# EAGLE design MBus-WeMOS (EAGLE 9.3.2)
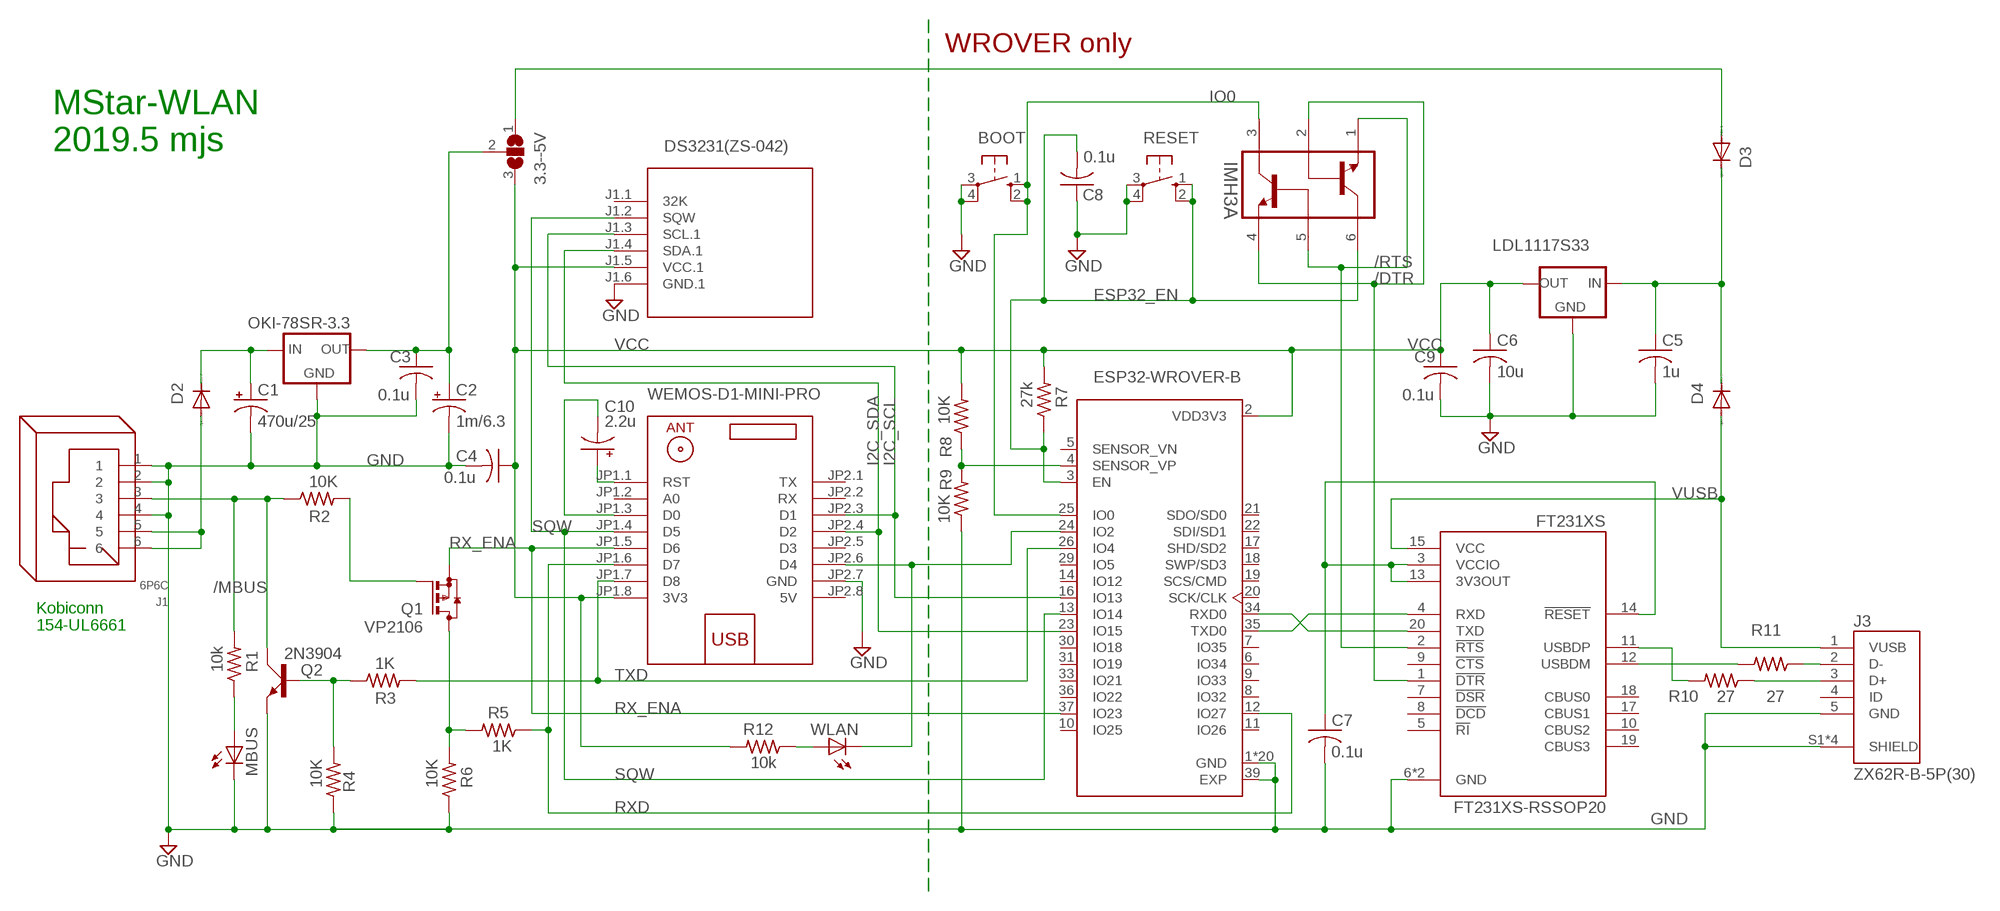
[diagram p0: schematic, sheet 1]

## Parts
3.3--5V  SJ2W  [SJ_2]
BOOT  10-XX  [B3F-10XX]
C1  470u/25  CPOL-USE3.5-8  [E3,5-8]
C2  1m/6.3  CPOL-USE5-10.5  [E5-10,5]
C3  0.1u  C-US025-024X044  [C025-024X044]
C4  0.1u  C-US025-024X044  [C025-024X044]
C5  1u  C-USC1206  [C1206]
C6  10u  C-USC1206  [C1206]
C7  0.1u  C-US025-024X044  [C025-024X044]
C8  0.1u  C-US025-024X044  [C025-024X044]
C9  0.1u  C-US025-024X044  [C025-024X044]
C10  2.2u  CPOL-USE2.5-5  [E2,5-5]
D2  DIODE-D-5  [D-5]
D3  DIODE-D-5  [D-5]
D4  DIODE-D-5  [D-5]
DS3231(ZS-042)  RTC-DS3231-AT24C32-6  [RTC-DS3231-AT24C32-6]
ESP32-WROVER-B  ESP32-WROVER-I  [XCVR_ESP32-WROVER-I]
FT231XS  FT231XS-RSSOP20  [SSOP20]
IMH3A  IMH3ATSOP6  [TSOP6]
J1  6P6C  RJ12  [RJ12]
J3  ZX62R-B-5P(30)  [HRS_ZX62R-B-5P(30)]
LDL1117S33  LM1117MP-3.3  [SOT223]
MBUS  LED3MM  [LED3MM]
OKI-78SR-3.3  78MXXS  [78MXXS]
Q1  VP2106  [TO92]
Q2  2N3904  [TO92D]
R1  10k  R-US_0207/2V  [0207/2V]
R2  10K  R-US_0207/2V  [0207/2V]
R3  1K  R-US_0207/2V  [0207/2V]
R4  10K  R-US_0207/2V  [0207/2V]
R5  1K  R-US_0207/2V  [0207/2V]
R6  10K  R-US_0207/2V  [0207/2V]
R7  27k  R-US_0207/2V  [0207/2V]
R8  10K  R-US_0207/2V  [0207/2V]
R9  10K  R-US_0207/2V  [0207/2V]
R10  27  R-US_0207/2V  [0207/2V]
R11  27  R-US_0207/2V  [0207/2V]
R12  10k  R-US_0207/2V  [0207/2V]
RESET  10-XX  [B3F-10XX]
U$1  WEMOS-D1-MINI-PRO  [WEMOS-D1-MINI-PRO]
WLAN  LED3MM  [LED3MM]

## Nets
/DTR: FT231XS.1(!DTR) IMH3A.2(Q1B) IMH3A.4(Q2E)
/MBUS: J1.3 Q2.C R1.2 R2.1
/RTS: FT231XS.2(!RTS) IMH3A.1(Q1E) IMH3A.5(Q2B)
ESP32_EN: C8.2 ESP32-WROVER-B.3(EN) IMH3A.6(Q1C) R7.1 RESET.1(S) RESET.2(S1)
GND [PWR]: BOOT.3(P) BOOT.4(P1) C1.- C2.- C3.2 C4.2 C5.2 C6.2 C7.2 C8.1 C9.2 DS3231(ZS-042).J1.6(GND.1) ESP32-WROVER-B.1(GND) ESP32-WROVER-B.15(GND) ESP32-WROVER-B.38(GND) ESP32-WROVER-B.39(EXP) ESP32-WROVER-B.40(GND) ESP32-WROVER-B.P$1(GND) ESP32-WROVER-B.P$2(GND) ESP32-WROVER-B.P$3(GND) ESP32-WROVER-B.P$4(GND) ESP32-WROVER-B.P$5(GND) ESP32-WROVER-B.P$6(GND) ESP32-WROVER-B.P$7(GND) ESP32-WROVER-B.P$8(GND) ESP32-WROVER-B.P$9(GND) ESP32-WROVER-B.P$10(GND) ESP32-WROVER-B.P$11(GND) ESP32-WROVER-B.P$12(GND) ESP32-WROVER-B.P$13(GND) ESP32-WROVER-B.P$14(GND) ESP32-WROVER-B.P$15(GND) ESP32-WROVER-B.P$16(GND) FT231XS.6(GND) FT231XS.16(GND) J1.1 J1.2 J1.4 J3.5(GND) J3.S1(SHIELD) J3.S2(SHIELD) J3.S3(SHIELD) J3.S6(SHIELD) LDL1117S33.1(GND) MBUS.K(C) OKI-78SR-3.3.GND Q2.E R4.1 R6.1 R9.1 RESET.3(P) RESET.4(P1) U$1.JP2.7(GND)
I2C_SCL: DS3231(ZS-042).J1.3(SCL.1) ESP32-WROVER-B.16(IO13) U$1.JP2.3(D1)
I2C_SDA: DS3231(ZS-042).J1.4(SDA.1) ESP32-WROVER-B.23(IO15) U$1.JP2.4(D2)
IO0: BOOT.1(S) BOOT.2(S1) ESP32-WROVER-B.25(IO0) IMH3A.3(Q2C)
N$1: MBUS.A R1.1
N$2: Q2.B R3.1 R4.2
N$3: Q1.G R2.2
N$4: C10.+ U$1.JP1.1(RST)
N$5: ESP32-WROVER-B.35(TXD0) FT231XS.4(RXD)
N$6: ESP32-WROVER-B.34(RXD0) FT231XS.20(TXD)
N$7: C10.- U$1.JP1.3(D0)
N$8: ESP32-WROVER-B.4(SENSOR_VP) R8.1 R9.2
N$9: J3.3(D+) R10.1
N$10: J3.2(D-) R11.1
N$11: FT231XS.11(USBDP) R10.2
N$12: Q1.D R5.2 R6.2
N$13: FT231XS.12(USBDM) R11.2
N$14 [PWR]: D2.A J1.5 J1.6
N$15: C7.1 FT231XS.3(VCCIO) FT231XS.13(3V3OUT) FT231XS.14(!RESET)
N$16 [PWR]: 3.3--5V.1 D3.A
N$17 [PWR]: C5.1 D3.C D4.C LDL1117S33.3(IN)
N$18: R12.1 WLAN.A
N$19: ESP32-WROVER-B.24(IO2) U$1.JP2.6(D4) WLAN.K(C)
N$20 [PWR]: 3.3--5V.2 C2.+ C3.1 OKI-78SR-3.3.OUT
RAW12 [PWR]: C1.+ D2.C OKI-78SR-3.3.IN
RX_ENA: ESP32-WROVER-B.37(IO23) Q1.S U$1.JP1.5(D6)
RXD: ESP32-WROVER-B.12(IO27) R5.1 U$1.JP1.6(D7)
SQW: DS3231(ZS-042).J1.2(SQW) ESP32-WROVER-B.13(IO14) U$1.JP1.4(D5)
TXD: ESP32-WROVER-B.26(IO4) R3.2 U$1.JP1.7(D8)
VCC [PWR]: 3.3--5V.3 C4.1 C6.1 C9.1 DS3231(ZS-042).J1.5(VCC.1) ESP32-WROVER-B.2(VDD3V3) LDL1117S33.2(OUT) LDL1117S33.4(OUT) R7.2 R8.2 R12.2 U$1.JP1.8(3V3)
VUSB [PWR]: D4.A FT231XS.15(VCC) J3.1(VUSB)
Unconnected: DS3231(ZS-042).J1.1(32K) ESP32-WROVER-B.5(SENSOR_VN) ESP32-WROVER-B.6(IO34) ESP32-WROVER-B.7(IO35) ESP32-WROVER-B.8(IO32) ESP32-WROVER-B.9(IO33) ESP32-WROVER-B.10(IO25) ESP32-WROVER-B.11(IO26) ESP32-WROVER-B.14(IO12) ESP32-WROVER-B.17(SHD/SD2) ESP32-WROVER-B.18(SWP/SD3) ESP32-WROVER-B.19(SCS/CMD) ESP32-WROVER-B.20(SCK/CLK) ESP32-WROVER-B.21(SDO/SD0) ESP32-WROVER-B.22(SDI/SD1) ESP32-WROVER-B.29(IO5) ESP32-WROVER-B.30(IO18) ESP32-WROVER-B.31(IO19) ESP32-WROVER-B.33(IO21) ESP32-WROVER-B.36(IO22) FT231XS.5(!RI) FT231XS.7(!DSR) FT231XS.8(!DCD) FT231XS.9(!CTS) FT231XS.10(CBUS2) FT231XS.17(CBUS1) FT231XS.18(CBUS0) FT231XS.19(CBUS3) J3.4(ID) U$1.JP1.2(A0) U$1.JP2.1(TX) U$1.JP2.2(RX) U$1.JP2.5(D3)

## Notes on the sheet
- WROVER only
- MStar-WLAN
  2019.5 mjs
- Kobiconn
  154-UL6661

## Power pins joined to a net without a drawn wire
5V: U$1.JP2.8(5V)

## Library data of the parts
3.3--5V = jumper:SJ2W: SMD solder JUMPER
BOOT RESET = switch-omron:10-XX: OMRON SWITCH; MPN: B3F-1000; OC_FARNELL: 176432; OC_NEWARK: 36M3542
C1 C2 C10 = rcl:CPOL-US: POLARIZED CAPACITOR, American symbol
C3-C9 = rcl:C-US: CAPACITOR, American symbol
D2-D4 = diode:DIODE-: DIODE
DS3231(ZS-042) = MyLibrary:RTC-DS3231-AT24C32-6: RTC Module with Battery and EEPROM based on DS3231 and AT24C32 chips Tutorial can be found here: https://edwardmallon.wordpress.com/2014/05/21/using-a-cheap-3-ds3231-rtc-at24c32-eeprom-from-ebay/ Click here to find device on ebay.com <http://www.ebay.com/sch/DS3231+AT24C32+module>
ESP32-WROVER-B = MyLibrary:ESP32-WROVER-I: Module: combo; GPIO, I2C x2, I2S x2, SDIO, SPI x3, UART x3; U.FL; AVAILABILITY: Unavailable; DESCRIPTION: Module: combo; GPIO, I2C x2, I2S x2, SDIO, SPI x3, UART x3; U.FL; MF: Espressif Systems; MP: ESP32-WROVER-I; PACKAGE: Module Espressif Systems; PRICE: None
FT231XS = MyLibrary:FT231XS-R: USB Full Speed to Full Handshake UART with USB Charger Detection; DESCRIPTION: USB Full Speed to Full Handshake UART with USB Charger Detection; DIGI-KEY_PART_NUMBER: 768-1129-1-ND; DIGI-KEY_PURCHASE_URL: https://www.digikey.com/product-detail/en/ftdi-future-technology-devices-international-ltd/FT231XS-R/768-1129-1-ND/3029151?utm_source=snapeda&utm_medium=aggregator&utm_campaign=symbol; MF: FTDI,; MP: FT231XS-R; PACKAGE: SSOP-20 FTDI
IMH3A = MyLibrary:IMH3A: https://www.mouser.com/ProductDetail/755-IMH3AT110
J1 = con-rj:RJ12: RJ12, RJ14 and RJ25 RJ12, RJ14 and RJ25 jacks side mounted http://www.tycoelectronics.com
J3 = MyLibrary:ZX62R-B-5P(30): ZX Series 5 Pin Single Port USB 2.0 Micro B Top Mount Receptacle Male; AVAILABILITY: Unavailable; DESCRIPTION: ZX Series 5 Pin Single Port USB 2.0 Micro B Top Mount Receptacle Male; MF: Hirose; MP: ZX62R-B-5P_30_; PACKAGE: None; PRICE: None
LDL1117S33 = MyLibrary:LM1117?-*: 800mA Low-Dropout Linear Regulator Source: http://www.ti.com/lit/ds/symlink/lm1117-n.pdf; MF: Texas Instruments; MPN: LM1117MP-3.3; OC_FARNELL: 9778195; OC_NEWARK: 28X3416
MBUS WLAN = adafruit:LED: LED OSRAM: - CHIPLED LG R971, LG N971, LY N971, LG Q971, LY Q971, LO R971, LY R971 LH N974, LH R974 LS Q976, LO Q976, LY Q976 LO Q996 - Hyper CHIPLED LW Q18S LB Q993, LB Q99A, LB R99A - SideLED LS A670, LO A670, LY A670, LG A670, LP A670 LB A673, LV A673, LT A673, LW A673 LH A674 LY A675 LS A676, LA A676, LO A676, LY A676, LW A676 LS A679, LY A679, LG A679 - Hyper Micro SIDELED® LS Y876, LA Y876, LO Y876, LY Y876 LT Y87S - SmartLED LW L88C, LW L88S LB L89C, LB L89S, LG L890 LS L89K, LO L89K, LY L89K LS L896, LA L896, LO L896, LY L896 - TOPLED LS T670, LO T670, LY T670, LG T670, LP T670 LSG T670, LSP T670, LSY T670, LOP T670, LYG T670 LG T671, LOG T671, LSG T671 LB T673, LV T673, LT T673, LW T673 LH T674 LS T676, LA T676, LO T676, LY T676, LB T676, LH T676, LSB T676, LW T676 LB T67C, LV T67C, LT T67C, LS T67K, LO T67K, LY T67K, LW E67C LS E67B, LA E67B, LO E67B, LY E67B, LB E67C, LV E67C, LT E67C LW T67C LS T679, LY T679, LG T679 LS T770, LO T770, LY T770, LG T770, LP T770 LB T773, LV T773, LT T773, LW T773 LH T774 LS E675, LA E675, LY E675, LS T675 LS T776, LA T776, LO T776, LY T776, LB T776 LHGB T686 LT T68C, LB T68C - Hyper Mini TOPLED® LB M676 - Mini TOPLED Santana® LG M470 LS M47K, LO M47K, LY M47K Source: http://www.osram.convergy.de/
OKI-78SR-3.3 = v-reg:78MXXS: VOLTAGE REGULATOR
Q1 = MyLibrary:VP2106: P-channel enhancement MOSFET
Q2 = transistor-small-signal:2N3904: NPN TRANSISTOR
R1-R12 = rcl:R-US_: RESISTOR, American symbol
U$1 = MyLibrary:WEMOS-D1-MINI-PRO: WEMOS D1 mini Pro: Mini Wi-Fi Board based on ESP-8266EX chip More details can be found here: https://www.wemos.cc/product/d1-mini-pro.html Click here to find device on ebay.com <http://www.ebay.com/sch/wemos+d1+mini+pro>

## Net classes
1 PWR: width 0.457 mm, drill 0.406 mm, clearance 0.152 mm

## Board
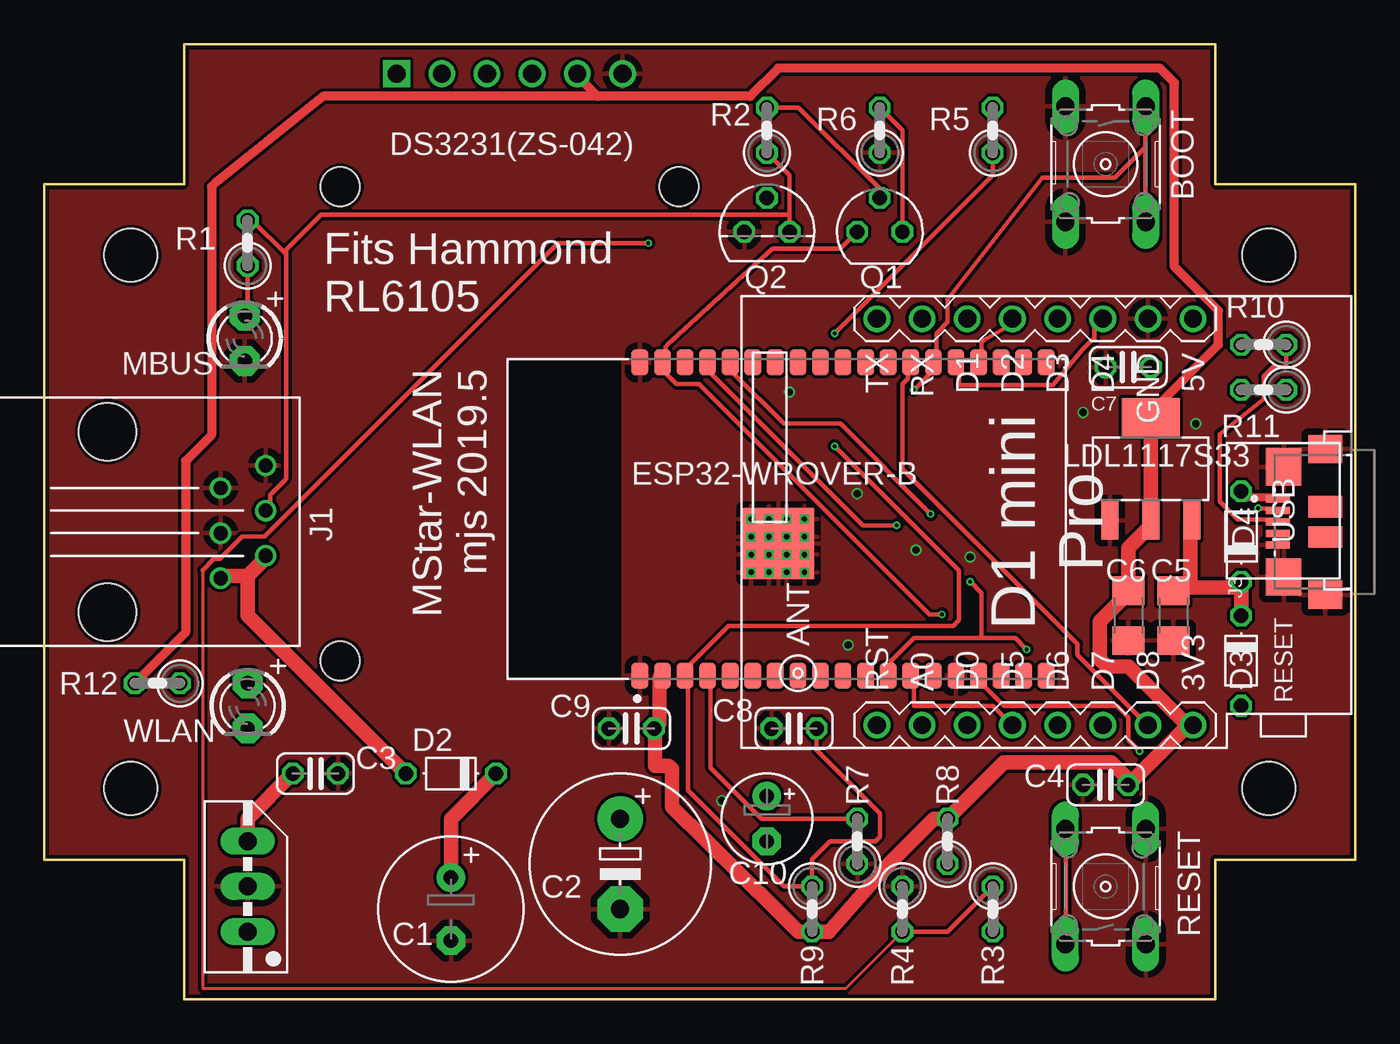
[diagram p1: board, top side]
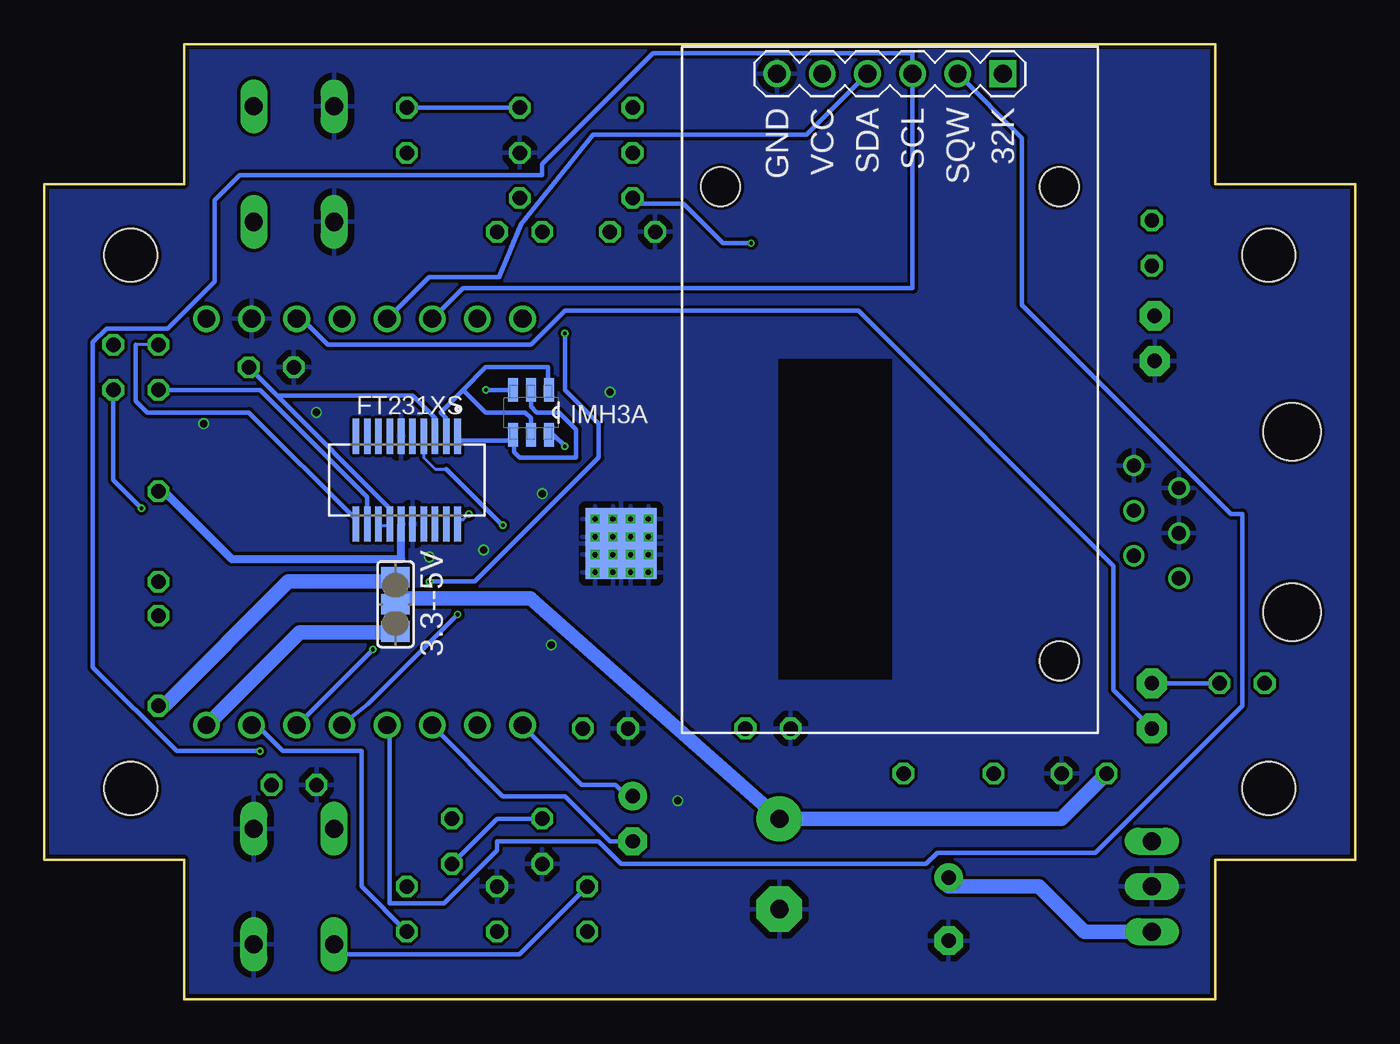
[diagram p2: board, bottom side, seen from below]

Size 73.72 x 53.72 mm. Coordinates in mm from the lower left corner, seen from the top.
Outline: 0,7.86 0,45.86 7.86,45.86 7.86,53.72 65.86,53.72 65.86,45.86 73.72,45.86 73.72,7.86 65.86,7.86 65.86,0 7.86,0 7.86,7.86 0,7.86
Copper layers (1*16): Top 0.035mm / dielectric 1.6mm / Bottom 0.035mm
Design rules "jlcpcb 7mil *": minimum track width 7mil, minimum drill 8mil, track to track 7mil, track to pad 7mil, pad to pad 7mil, via to via 7mil, smd to smd 0mil, copper to edge 8mil, drill to drill 8mil, minimum pad ring 4mil, minimum via ring 4mil, stop-mask expansion 0mil, vias tented up to drill 100mil, thermal gap 15mil
Holes 3 mm at 4.86,11.86 4.86,41.86 68.86,11.86 68.86,41.86

### Footprints (pad centres in the part's own frame; a part is rotated, then mirrored left to right if it is on the bottom)
SJ_2 = smd 1.168 x 1.6: 1 -1.524,0; 2 0,0; 3 1.524,0
B3F-10XX = drill 1.016 long: 1 -3.251,2.261; 2 3.251,2.261; 3 -3.251,-2.261; 4 3.251,-2.261
E3,5-8 = drill 0.813 pad 1.6: + -1.778,0 | drill 0.813 pad 1.6 octagon: - 1.778,0
E5-10,5 = drill 1.016 pad 2.54: + -2.54,0 | drill 1.016 pad 2.54 octagon: - 2.54,0
C025-024X044 = drill 0.813 octagon: 1 -1.27,0; 2 1.27,0
C1206 = smd 1.6 x 1.8: 1 -1.4,0; 2 1.4,0
E2,5-5 = drill 0.813 pad 1.6: + -1.27,0 | drill 0.813 pad 1.6 octagon: - 1.27,0
D-5 = drill 0.813 octagon: A 2.54,0; C -2.54,0
RTC-DS3231-AT24C32-6 = drill 1 square: J1.1 -17.78,6.35 | drill 1: J1.2 -17.78,3.81; J1.3 -17.78,1.27; J1.4 -17.78,-1.27; J1.5 -17.78,-3.81; J1.6 -17.78,-6.35 | hole 2.2: -11.43,-9.525; -11.43,9.525; 15.24,9.525
XCVR_ESP32-WROVER-I = smd 1.45 x 0.93: 1 -8.81,8.26; 2 -8.81,6.99; 3 -8.81,5.72; 4 -8.81,4.45; 5 -8.81,3.18; 6 -8.81,1.91; 7 -8.81,0.64; 8 -8.81,-0.63; 9 -8.81,-1.9; 10 -8.81,-3.17; 11 -8.81,-4.44; 12 -8.81,-5.71; 13 -8.81,-6.98; 14 -8.81,-8.25; 15 -8.81,-9.52; 16 -8.81,-10.79; 17 -8.81,-12.06; 18 -8.81,-13.33; 19 -8.81,-14.6; 20 8.81,-14.6; 21 8.81,-13.33; 22 8.81,-12.06; 23 8.81,-10.79; 24 8.81,-9.52; 25 8.81,-8.25; 26 8.81,-6.98; 27 8.81,-5.71; 28 8.81,-4.44; 29 8.81,-3.17; 30 8.81,-1.9; 31 8.81,-0.63; 32 8.81,0.64; 33 8.81,1.91; 34 8.81,3.18; 35 8.81,4.45; 36 8.81,5.72; 37 8.81,6.99; 38 8.81,8.26 | smd 4 x 4: 39 -1.38,0.47 | smd 4 x 4 bottom: 40 -1.38,0.47 | drill 0.3 pad 0.406 square: P$1 -3,2; P$2 -2,2; P$3 -1,2; P$4 0,2; P$5 0,1; P$6 -1,1; P$7 -2,1; P$8 -3,1; P$9 -3,0; P$10 -2,0; P$11 -1,0; P$12 0,0; P$13 0,-1; P$14 -1,-1; P$15 -2,-1; P$16 -3,-1
SSOP20 = smd 1.97 x 0.41: 1 -2.47,2.857; 2 -2.47,2.223; 3 -2.47,1.587; 4 -2.47,0.953; 5 -2.47,0.318; 6 -2.47,-0.318; 7 -2.47,-0.953; 8 -2.47,-1.587; 9 -2.47,-2.223; 10 -2.47,-2.857; 11 2.47,-2.857; 12 2.47,-2.223; 13 2.47,-1.587; 14 2.47,-0.953; 15 2.47,-0.318; 16 2.47,0.318; 17 2.47,0.953; 18 2.47,1.587; 19 2.47,2.223; 20 2.47,2.857
TSOP6 = smd 1.321 x 0.559: 1 -1.27,1.016; 2 -1.27,0; 3 -1.27,-1.016; 4 1.27,-1.016; 5 1.27,0; 6 1.27,1.016
RJ12 = drill 0.8: 1 -8.89,-3.175; 2 -6.35,-1.905; 3 -8.89,-0.635; 4 -6.35,0.635; 5 -8.89,1.905; 6 -6.35,3.175 | hole 3.25: 0,-5.08; 0,5.08
HRS_ZX62R-B-5P(30) = smd 0.4 x 1.35: 1 1.3,2.675; 2 0.65,2.675; 3 0,2.675; 4 -0.65,2.675; 5 -1.3,2.675 | smd 2.1 x 2: S1 -3.1,2.35; S2 3.1,2.35 | smd 1.6 x 1.9: S3 4.1,0; S6 -4.1,0 | smd 1.2 x 1.9: S4 0.85,0; S5 -0.85,0
SOT223 = smd 0.95 x 2.15: 1 -2.3,-2.9; 2 0,-2.9; 3 2.3,-2.9 | smd 3.25 x 2.15: 4 0,2.9
LED3MM = drill 0.813 pad 1.676 octagon: A -1.27,0; K 1.27,0
78MXXS = drill 1.016 long: GND 0,-2.54; IN -2.54,-2.54; OUT 2.54,-2.54
TO92 = drill 0.813 octagon: D 1.27,0; G 0,1.905; S -1.27,0
TO92D = drill 0.813 octagon: B 0,1.905; C 1.27,0; E -1.27,0
0207/2V = drill 0.813 octagon: 1 -1.27,0; 2 1.27,0
WEMOS-D1-MINI-PRO = drill 1: JP1.1 -11.43,9.525; JP1.2 -11.43,6.985; JP1.3 -11.43,4.445; JP1.4 -11.43,1.905; JP1.5 -11.43,-0.635; JP1.6 -11.43,-3.175; JP1.7 -11.43,-5.715; JP1.8 -11.43,-8.255; JP2.1 11.43,9.525; JP2.2 11.43,6.985; JP2.3 11.43,4.445; JP2.4 11.43,1.905; JP2.5 11.43,-0.635; JP2.6 11.43,-3.175; JP2.7 11.43,-5.715; JP2.8 11.43,-8.255

### Placement (x,y rotation side)
3.3--5V  53.98,22.23 270 bottom
BOOT  59.69,46.99 270 top
C1  22.86,5.08 270 top
C2  32.38,7.62 270 top
C3  15.24,12.7 0 top
C4  59.69,12.06 180 top
C5  63.5,21.59 270 top
C6  60.96,21.59 270 top
C7  60.96,35.56 180 top
C8  42.16,15.24 0 top
C9  33.02,15.24 180 top
C10  40.64,10.16 270 top
D2  22.86,12.7 180 top
D3  67.31,19.05 270 top
D4  67.31,26.04 90 top
DS3231(ZS-042)  26.16,34.29 270 bottom
ESP32-WROVER-B  41.75,27.02 90 top
FT231XS  53.34,29.21 270 bottom
IMH3A  46.35,33.02 270 bottom
J1  3.56,26.86 180 top
J3  72.05,26.86 90 top
LDL1117S33  62.23,29.84 0 top
MBUS  11.27,37.18 270 top
OKI-78SR-3.3  8.89,6.35 90 top
Q1  46.99,43.18 0 top
Q2  40.64,43.18 0 top
R1  11.43,42.55 90 top
R2  40.64,48.9 90 top
R3  53.34,5.08 270 top
R4  48.26,5.08 270 top
R5  53.34,48.9 90 top
R6  46.99,48.9 90 top
R7  43.18,5.08 270 top
R8  50.8,8.89 90 top
R9  45.72,8.89 90 top
R10  68.58,36.83 180 top
R11  68.58,34.29 180 top
R12  6.35,17.78 180 top
RESET  59.69,6.35 90 top
U$1  56.35,26.86 90 top
WLAN  11.43,16.51 270 top

### Tracks (layer width: path | path; a pad name or v marks a point on that pad's centre or on a via)
/DTR
  Bottom 0.178: 50.48,31.43 FT231XS.1 | 47.31,31.75 47.31,31.43 IMH3A.4 47.31,31.75
  Bottom 0.254: IMH3A.2 46.35,33.34 46.04,33.02 44.77,33.02 43.81,32.07 43.81,30.48 46.99,30.48 47.31,30.8 47.31,31.43 50.48,31.43
/MBUS
  Top 0.178: 12.7,27.62 J1.3
  Top 0.254: 41.91,44.13 41.91,46.35 R2.1 | 41.91,44.13 Q2.C | 12.7,27.62 12.7,28.38 13.59,29.27 13.59,41.91 | 13.59,41.91 13.59,42.16 15.56,44.13 41.91,44.13 | 13.59,41.91 11.68,43.81 R1.2
/RTS
  Bottom 0.178: FT231XS.2 51.12,32.7 | 45.4,34.29 IMH3A.1
  Bottom 0.254: 45.4,34.29 45.4,35.56 48.9,35.56 50.16,34.29 | 50.16,34.29 51.44,33.02 51.12,32.7 | IMH3A.5 46.35,32.7 46.67,33.02 48.9,33.02 50.16,34.29
ESP32_EN  (via drill 0.2)
  Top 0.178: 35.88,18.41 ESP32-WROVER-B.3 36.2,18.1 | 57.47,3.17 RESET.1 | 57.47,9.53 RESET.2
  Top 0.254: v44.45,31.11 51.44,24.13 51.44,21.34 51.12,21.02 38.48,21.02 35.88,18.41 | 57.47,9.53 57.47,3.17 | 36.2,18.1 36.2,11.75 41.59,6.35 R7.1 43.18,7.87 44.2,8.89 46.74,8.89 46.99,9.14 46.99,10.48 43.43,14.03 C8.2
  Bottom 0.178: 45.09,31.75 IMH3A.6 | 56.83,2.54 57.15,2.86
  Bottom 0.254: v44.45,31.11 45.09,31.75 | 56.83,2.54 46.99,2.54 R7.1 | 57.15,2.86 RESET.1
GND  (via drill 0.41)
  Top 0.457: 41.91,26.04 42.55,26.04 ESP32-WROVER-B.P$14 | 41.91,26.04 ESP32-WROVER-B.40 | 41.91,26.04 ESP32-WROVER-B.P$11
  other vias: 52.07,24.89 58.42,33.02 45.72,28.45 64.77,32.38 49.02,25.27 45.21,19.94 38.1,11.18 41.91,34.16
  pour Top: -8.26,57.78 81.28,57.78 81.28,-5.08 -8.89,-5.08
  pour Bottom: -9.53,59.05 82.55,59.05 82.55,-6.99 -10.79,-6.99 -10.79,59.05
I2C_SCL  (via drill 0.2)
  Top 0.178: 52.7,17.78 ESP32-WROVER-B.16
  Top 0.254: 52.7,17.78 53.98,16.51 60.33,16.51 60.96,15.88 60.96,14.61 v61.59,13.97
  Bottom 0.254: U$1.JP2.3 51.44,38.73 50.16,40.01 24.89,40.01 DS3231(ZS-042).J1.3 24.89,53.21 39.5,53.21 45.72,46.99 45.72,46.35 62.74,46.35 64.14,44.96 64.14,40.39 66.78,37.74 70.23,37.74 70.99,36.98 70.99,18.67 66.29,13.97 v61.59,13.97
I2C_SDA
  Top 0.178: 52.7,36.2 ESP32-WROVER-B.23
  Top 0.254: 52.7,36.2 52.7,36.96 52.83,37.08 54.61,38.1 U$1.JP2.4
  Bottom 0.254: DS3231(ZS-042).J1.4 30.86,48.64 42.87,48.64 46.91,43.61 48.15,40.64 52.07,40.64 53.98,38.73 U$1.JP2.4
IO0  (via drill 0.2)
  Top 0.178: 50.16,35.56 ESP32-WROVER-B.25 50.16,35.88 | 61.91,50.48 BOOT.1 61.91,50.16 | 61.91,43.81 BOOT.2
  Top 0.254: 50.16,35.56 v48.9,34.29 | 50.16,35.88 50.16,37.47 50.8,38.1 50.8,39.37 56.13,46.23 60.2,46.23 61.91,47.94 61.91,50.48 | 61.91,50.16 61.91,43.81
  Bottom 0.254: v48.9,34.29 IMH3A.3
N$1
  Top 0.178: 11.43,38.73 MBUS.A
  Top 0.254: 11.43,38.73 R1.1
N$2  (via drill 0.2)
  Top 0.178: 8.89,24.13 8.89,0.64 45.09,0.64 R4.2
  Top 0.254: R4.2 50.8,3.81 R3.1 | v33.97,42.55 28.89,42.55 12.38,26.04 11.11,26.04 9.84,24.77 9.53,24.77 8.89,24.13
  Bottom 0.254: Q2.B 40.32,44.77 37.78,44.77 35.56,42.55 v33.97,42.55
N$3
  Top 0.254: R2.2 42.42,50.16 46.99,45.59 Q1.G
N$4
  Bottom 0.178: C10.+ 40.96,11.43 | 46.67,15.24 U$1.JP1.1
  Bottom 0.254: 46.67,15.24 43.5,12.06 41.59,12.06 40.96,11.43
N$5  (via drill 0.2)
  Top 0.178: 37.47,35.24 37.47,35.56 ESP32-WROVER-B.35
  Top 0.254: 37.47,35.24 46.04,26.67 v47.94,26.67
  Bottom 0.178: 51.12,29.84 51.75,29.84 52.39,30.48 FT231XS.4
  Bottom 0.254: 51.12,29.84 v47.94,26.67
N$6  (via drill 0.2)
  Top 0.178: 38.73,35.24 38.73,35.56 ESP32-WROVER-B.34
  Top 0.254: 38.73,35.24 41.59,32.38 44.77,32.38 v49.85,27.3
  Bottom 0.178: v49.85,27.3 50.16,26.99 50.48,26.99 FT231XS.20
N$7
  Bottom 0.178: 51.75,15.24 U$1.JP1.3
  Bottom 0.254: 51.75,15.24 47.94,11.43 44.45,11.43 41.91,8.89 C10.-
N$8
  Top 0.178: 37.47,18.1 ESP32-WROVER-B.4
  Top 0.254: 37.47,18.1 37.47,13.02 40.32,10.16 R9.2
  Bottom 0.254: R8.1 48.26,10.16 R9.2
N$9
  Top 0.178: 69.22,26.99 J3.3
  Top 0.254: 69.22,26.99 67.12,26.99 66.1,28 66.1,31.81 68.58,33.78 68.58,35.05 69.09,35.56 69.85,35.56 R10.1
N$10  (via drill 0.2)
  Top 0.178: 69.22,27.62 J3.2
  Top 0.254: v68.26,27.62 69.22,27.62
  Bottom 0.254: v68.26,27.62 69.85,29.21 R11.1
N$11
  Bottom 0.178: R10.2 68.58,36.83 | 56.2,26.99 FT231XS.11
  Bottom 0.254: 56.2,26.99 62.23,33.02 67.94,33.02 68.58,33.66 68.58,36.83
N$12
  Top 0.254: Q1.D 48.26,48.9 R6.2
  Bottom 0.254: R6.2 R5.2
N$13
  Bottom 0.254: FT231XS.12 55.56,28.26 61.59,34.29 R11.2
N$14
  Top 0.457: 10.16,23.81 J1.6 | 12.38,24.77 J1.5
  Top 0.813: 11.43,23.81 10.16,23.81 | 12.38,24.77 11.43,23.81 | D2.A 11.43,21.59 11.43,23.81
N$15
  Bottom 0.178: FT231XS.13 54.93,26.67 54.29,26.67 FT231XS.14 54.29,27.62 | 51.75,32.7 FT231XS.3
  Bottom 0.254: 51.75,32.7 53.02,33.97 60.64,33.97 | C7.1 60.64,33.97 | 60.64,33.97 54.29,27.62
N$16
  Bottom 0.457: D3.A 66.99,16.51 | 53.98,23.5 3.3--5V.1
  Bottom 0.813: 53.98,23.5 60.01,23.5 66.99,16.51
N$17
  Top 0.457: 64.45,23.18 63.5,23.18 C5.1 | D4.C 66.99,23.18 | 64.45,26.67 LDL1117S33.3
  Top 0.813: 66.99,23.18 64.45,23.18 64.45,26.67 | D4.C D3.C
N$18
  Bottom 0.254: WLAN.A R12.1
N$19
  Top 0.178: 51.44,35.56 ESP32-WROVER-B.24 | 59.05,38.1 U$1.JP2.6
  Top 0.254: 51.44,35.56 51.44,34.54 56.73,34.54 58.42,36.58 58.93,37.08 59.05,37.08 59.05,38.1
  Bottom 0.254: WLAN.K 13.59,17.4 13.59,24.38 27.94,38.73 44.45,38.73 46.35,36.83 57.78,36.83 59.05,38.1 U$1.JP2.6
N$20
  Top 0.813: C3.1 11.43,10.16 OKI-78SR-3.3.OUT
  Bottom 0.457: 53.66,22.54 3.3--5V.2
  Bottom 0.813: 53.66,22.54 46.37,22.54 C2.+ 16.51,10.16 C3.1
RAW12
  Top 0.813: D2.C 22.86,10.16 C1.+
  Bottom 0.457: 22.86,6.35 C1.+
  Bottom 0.813: OKI-78SR-3.3.IN 15.24,3.81 17.78,6.35 22.86,6.35
RX_ENA  (via drill 0.2)
  Top 0.178: 34.92,36.2 34.92,35.88 ESP32-WROVER-B.37 34.61,35.56
  Top 0.254: 34.92,36.2 34.92,36.7 35.05,36.83 40.96,42.23 44.77,42.23 Q1.S | v50.48,21.65 49.78,21.65 36.83,34.61 35.56,34.61 34.61,35.56
  Bottom 0.254: v50.48,21.65 55.52,16.61 U$1.JP1.5
RXD  (via drill 0.2)
  Top 0.178: 47.62,18.41 ESP32-WROVER-B.12
  Top 0.254: 47.62,18.41 47.62,19.05 48.9,20.32 52.7,20.32 | 52.7,20.32 54.61,20.32 v55.24,19.68 | R5.1 53.34,46.35 v44.45,37.47 | v52.07,23.5 52.7,22.86 52.7,20.32
  Bottom 0.178: 59.05,15.88 U$1.JP1.6
  Bottom 0.254: 59.05,15.88 v55.24,19.68 | v44.45,37.47 44.45,34.29 42.55,32.38 42.55,30.48 49.53,23.5 v52.07,23.5
SQW
  Top 0.178: 48.9,18.1 ESP32-WROVER-B.13
  Top 0.254: 48.9,18.1 48.9,16.51 53.34,16.51 54.29,15.56 U$1.JP1.4
  Bottom 0.254: DS3231(ZS-042).J1.2 18.73,48.45 18.73,39.05 6.99,27.3 6.35,27.3 6.35,16.51 14.61,8.26 23.5,8.26 24.13,7.62 41.27,7.62 42.55,8.89 48.26,8.89 48.26,8.38 48.96,7.68 49.28,7.37 51.24,5.4 54.29,5.4 54.29,15.24 U$1.JP1.4
TXD
  Top 0.178: 48.58,35.56 ESP32-WROVER-B.26 | 61.91,15.56 U$1.JP1.7
  Top 0.254: 48.58,35.56 48.58,34.92 48.26,34.61 48.26,29.84 58.1,20 58.1,19.37 61.91,15.56
  Bottom 0.178: 61.59,15.24 61.91,15.24 U$1.JP1.7
  Bottom 0.254: R3.2 55.88,6.35 55.88,13.97 60.33,13.97 61.59,15.24
VCC
  Top 0.457: 64.45,15.56 U$1.JP1.8 64.14,15.56 | 34.61,15.56 C9.1 34.35,15.24 | 34.61,18.1 ESP32-WROVER-B.2 | R8.2 50.48,10.16 | 60.96,12.38 C4.1 | 62.23,26.67 LDL1117S33.2 | 62.23,33.02 LDL1117S33.4 | 60.96,22.86 C6.1 | 9.65,45.97 9.4,45.72
  Top 0.508: 31.11,50.8 29.97,51.94 DS3231(ZS-042).J1.5 | 31.11,50.8 39.69,50.8 41.27,52.39 62.74,52.39 63.56,51.56 63.56,41.21 66.04,38.73 66.04,36.83 62.23,33.02 | R12.2 7.94,20.64 7.94,30.29 9.4,31.75 9.4,45.72 | 9.65,45.97 15.68,50.8 31.11,50.8
  Top 0.813: 64.45,15.56 C4.1 | 34.61,15.56 34.61,18.1 | 50.48,10.16 50.04,10.16 47.5,7.62 44.13,3.81 R7.2 42.42,3.81 41.15,5.08 35.31,10.83 35.31,12.95 35.12,13.14 34.35,13.14 34.35,15.24 | 60.96,12.38 60.01,13.34 53.98,13.34 R8.2 | C6.1 60.96,25.4 62.23,26.67 | LDL1117S33.4 LDL1117S33.2 | 64.14,15.56 60.96,18.73 59.75,18.73 59.37,19.11 59.37,21.27 60.96,22.86
  Bottom 0.457: 64.14,15.88 64.14,15.56 64.45,15.56 U$1.JP1.8 | 53.98,20.64 3.3--5V.3
  Bottom 0.813: 53.98,20.64 59.37,20.64 64.14,15.88
VUSB
  Top 0.457: D4.A 67.63,28.26 69.22,28.26 J3.1
  Bottom 0.457: FT231XS.15 53.66,24.77 63.18,24.77 66.99,28.57 D4.A

### Text on the board
tNames: Fits Hammond / RL6105 | MStar-WLAN / mjs 2019.5 | ESP32-WROVER-B